# Altium schematic sheet FTDI.SchDoc
size A4; SheetNumber: 4; SheetTotal: 4
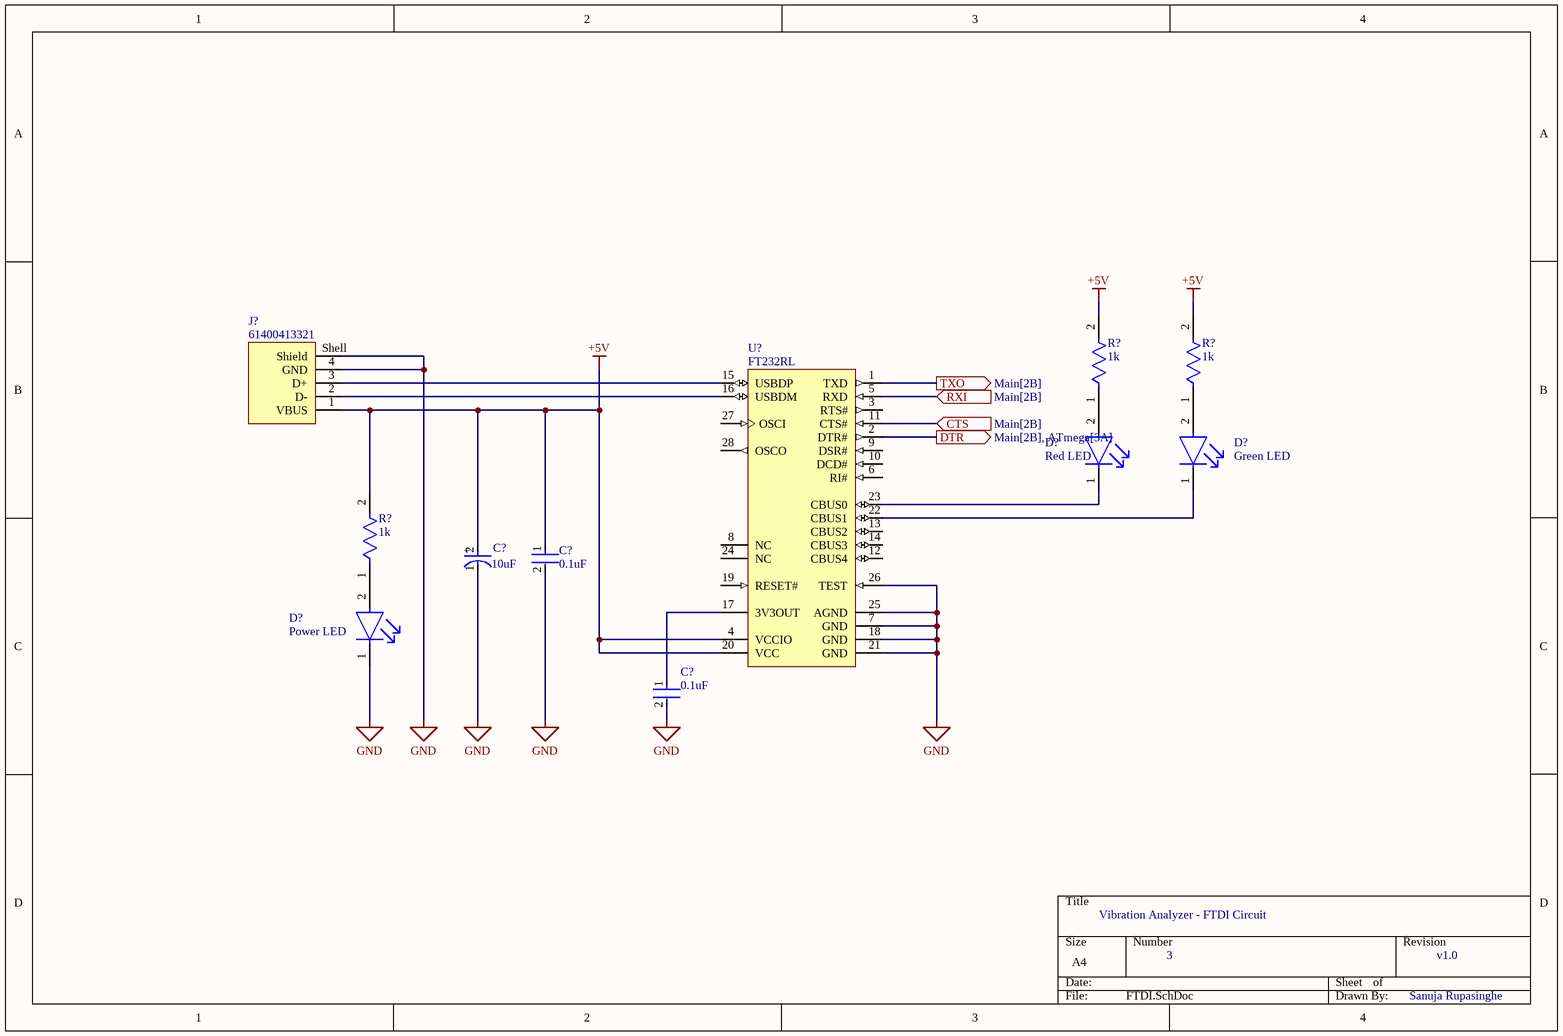
[diagram p0: FTDI.SchDoc]

## Parts
(Parts that share a designator on the sheet are numbered #1, #2 ... from top to bottom, then left to right.)
C?#1  Capacitance: 10uF  [FP-SC-MFG]  (hidden comment: EEE1VA100SR)
C?#2  Capacitance: 0.1uF  [FP-GRM31M-0_15-IPC_A]  (hidden comment: GRM31M1X1H104JA01L)
C?#3  Capacitance: 0.1uF  [FP-GRM31M-0_15-IPC_A]  (hidden comment: GRM31M1X1H104JA01L)
D?#1  Color: Red LED  [FP-HSMG-C150-MFG]  (hidden comment: HSMG-C150)
D?#2  Color: Green LED  [FP-HSMG-C150-MFG]  (hidden comment: HSMG-C150)
D?#3  Color: Power LED  [FP-HSMG-C150-MFG]  (hidden comment: HSMG-C150)
J?  61400413321  [61400413321]
R?#1  Resistance: 1k  [FP-MCR18-IPC_B]  (hidden comment: MCR18EZPF30R0)
R?#2  Resistance: 1k  [FP-MCR18-IPC_B]  (hidden comment: MCR18EZPF30R0)
R?#3  Resistance: 1k  [FP-MCR18-IPC_B]  (hidden comment: MCR18EZPF30R0)
U?  FT232RL  [FTDI-SSOP-28_M]

## Ports
CTS (in, see Main[2B]), DTR (out, see Main[2B], ATmega[3A]), RXI (in, see Main[2B]), TXO (out, see Main[2B])

## Nets
+5V: C?#1.2(A) C?#2.1 J?.1(VBUS) R?#1.2 R?#2.2 R?#3.2 U?.4(VCCIO) U?.20(VCC)
GND: C?#1.1(C) C?#2.2 C?#3.2 D?#3.1(C) J?.4(GND) J?.Shell(Shield) U?.7(GND) U?.18(GND) U?.21(GND) U?.25(AGND) U?.26(TEST)
CTS: U?.11(CTS#) ; port CTS
DTR: U?.2(DTR#) ; port DTR
RXI: U?.5(RXD) ; port RXI
TXO: U?.1(TXD) ; port TXO
NetC?#3_1: C?#3.1 U?.17(3V3OUT)
NetD?#1_1: D?#1.1(C) U?.23(CBUS0)
NetD?#1_2: D?#1.2(A) R?#1.1
NetD?#2_1: D?#2.1(C) U?.22(CBUS1)
NetD?#2_2: D?#2.2(A) R?#2.1
NetD?#3_2: D?#3.2(A) R?#3.1
NetJ?_2: J?.2(D-) U?.16(USBDM)
NetJ?_3: J?.3(D+) U?.15(USBDP)

Not connected (* = marked no-connect by the designer): U? 3(RTS#) 6(RI#) 8(NC) 9(DSR#) 10(DCD#) 12(CBUS4) 13(CBUS2) 14(CBUS3) 19(RESET#) 24(NC) 27(OSCI) 28(OSCO)

## Notes on the sheet
- Vibration Analyzer - FTDI Circuit
- 3
- v1.0
- Sanuja Rupasinghe
- (in symbol CMP-05427-000087-1) +

## Library data of the parts
C?#1 = CMP-05427-000087-1: CAP ALUM 10UF 20% 35V SMD; Life (Hours): 2000Hour; Lead Length: 2.2mm; Ripple Current (AC): 30mA; Leakage Current: 3uA; Length: 5.5mm; Construction: Cylindrical; Diameter: 5mm; RoHS Compliant: Yes; REACH SVHC: No SVHC; Max Operating Temperature: 85°C; Series: S; Case/Package: Radial; Contact Plating: Tin; Packaging: Tape and Reel; Voltage Rating: 35V; Number of Pins: 2; Height: 5.4mm; Width: 5.3mm; Voltage Rating (DC): 35V; Mount: Surface Mount; Tolerance: 20%; Lead Pitch: 1.5mm; Radiation Hardening: No; Height - Seated (Max): 0.213inch; Ripple Current: 30mA; Voltage: 35V; Package Quantity: 1; Termination: SMD/SMT; Min Operating Temperature: -40°C
C?#2 C?#3 = CMP-06035-007547-1: Chip Multilayer Ceramic Capacitors for General Purpose, 1206, 0.10uF, SL, +350/-1000ppm/°C, 5%, 50V; Dissipation Factor: 0.025%; Packaging: Tape and Reel; Length: 0.126inch; Case Code (Imperial): 1206; Voltage Rating (DC): 50V; Max Operating Temperature: 125°C; Voltage: 50V; Height: 1.15mm; Width: 0.063inch; Voltage Rating: 50V; Tolerance: 5%; Min Operating Temperature: -55°C; Mount: Surface Mount; Dielectric Material: Ceramic; Termination: SMD/SMT; Depth: 1.6mm; Case Code (Metric): 3216; Case/Package: 1206; Temperature Coefficient: -1000ppm/°C; Thickness: 0.049inch
D?#1-D?#3 = CMP-2000-05061-2: LED GREEN DIFFUSED 1206 SMD; Manufacturer: Broadcom; Led Orientation: Top View; Max Junction Temp: +95°C; Peak Emmision Wavelength: 570nm; Viewing Angle: 170°; Wavelength: 572nm; Reverse Voltage: 5V; Luminous Intensity: 15mcd; Forward Voltage: 2.2V; Power Dissipation: 65mW; Forward Current: 20mA; ComponentLink2Description: Datasheet; Lead Free: Yes; Temperature Range Low: -40°C; Package: HSMG-C150; Digikey Description: LED GREEN DIFFUSED 1206 SMD; Mouser Description: LED Uni-Color Green 570nm 2-Pin Chip LED T/R; Manufacturer Part Number: HSMG-C150; Temperature Range High: +85°C; Device Class L1: Optoelectronics; Colour: Green; Category: Diode; Device Class L3: unset; RoHS: TRUE; Height: 1.2mm; ComponentLink2URL: https://docs.broadcom.com/docs/AV02-0551EN; Device Class L2: LEDs; Automotive: No; Ipc Land Pattern Name: DIOCP320160X55; Octopart: https://octopart.com/hsmg-c150-broadcom-71131304; Temperature: -40°C to +85°C
J? = CMP-1502-03246-2: NexarPartId: 18818176; Contact Resistance: 20mΩ; USB Standard: USB 2.0; Current Rating: 1.5A; Number of Positions: 4; Number of Ports: 1; Gender: Receptacle; Voltage Rating: 30V; Connector Type: USB; Insulation Resistance: 1GΩ; Contact Plating: Gold; Termination: Solder; Number of Pins: 4; REACH SVHC: Unknown; Lead Free: Lead Free; Contact Material: Gold; Color: White; RoHS: Compliant; Number of Contacts: 4; Length: 14.8mm; Width: 19.15mm; Mount: PCB, Through Hole, Vertical; Orientation: Vertical; Insulation Material: PBT; Features: Shielded; Operating Supply Voltage: 30V; Min Operating Temperature: -40°C; Max Operating Temperature: 105°C; Height: 16.3mm
R?#1-R?#3 = CMP-08839-012195-1: Thick Film Chip Resistor, 1206, 30Ω, 1%, 100ppm/°C, 0.25W, 200V; Max Power Dissipation: 250mW; Case Code (Imperial): 1206; Case Code (Metric): 3216; Resistor Type: Thick Film; Tolerance: 1%; Package Quantity: 5000; Height: 0.026inch; RoHS Compliant: Yes; Series: MCR18; Number of Terminations: 2; Lead Free: Lead Free; Width: 0.063inch; Length: 0.126inch; Case/Package: 1206; Packaging: Tape and Reel; Features: Automotive AEC-Q200; Voltage Rating (DC): 200V; Temperature Coefficient: 100ppm/°C
U? = CMP-2000-05029-1: IC USB FS SERIAL UART 28-SSOP; Manufacturer: FTDI; Receive FIFO: 256B; Number of Channels per Chip: 1; Maximum Data Rate: 3MBd; Transmit FIFO: 128B; Dimensions: 10.2x5.3x1.75mm; Mounting Type: SurfaceMount; Height: 1.75mm; Package Type: SSOP; Datasheet Version: Rev. 1.04, 02/2006; Width: 5.3mm; Manufacturer URL: http://www.ftdichip.com/; Datasheet URL: http://datasheet.octopart.com/FT232RL-FTDI-datasheet-120501.pdf; Maximum Operating Temperature: +85degC; Minimum Operating Temperature: -40degC; Pin Count: 28; Length: 10.2mm